# Altium project lps_display_rev_10.PrjPcb
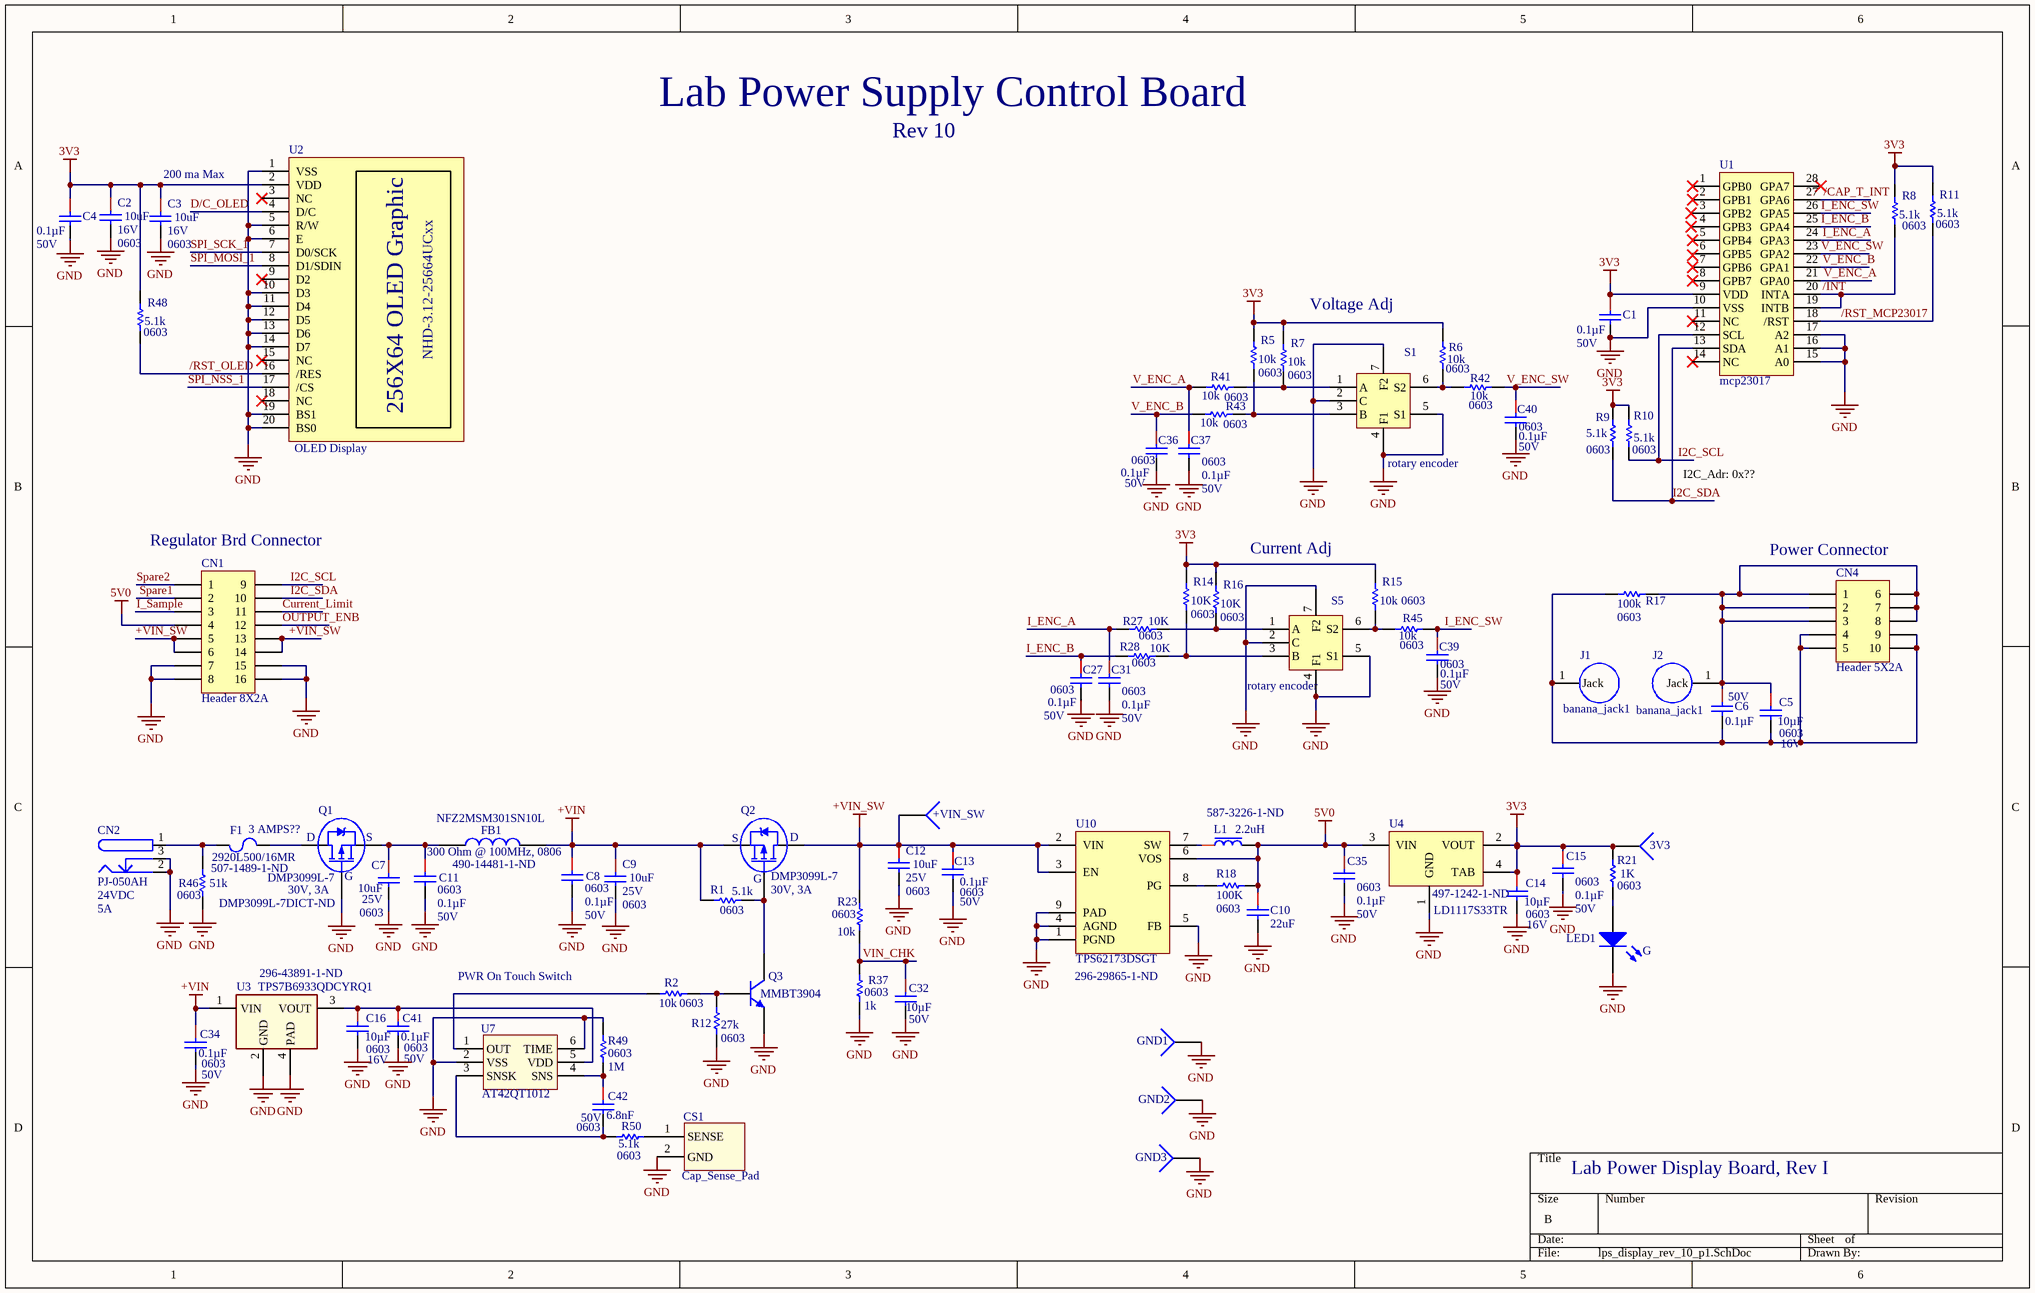
[diagram p0: lps_display_rev_10_p1.SchDoc]
2 sheets, 137 parts. Net scope: global (net labels, ports and power ports of the same name join across sheets).
Board file: lps_display_rev_10.PcbDoc
Sheets:
  lps_display_rev_10_p1.SchDoc
  lps_display_rev_10_p2.SchDoc

## Sheet lps_display_rev_10_p1.SchDoc
size B; Revision: F; SheetNumber: 1; SheetTotal: 2

### Parts
3V3  (no value)  [TestPoint-TH 35 mil]  (no BOM)
+VIN_SW  (no value)  [TestPoint-TH 35 mil]  (no BOM)
C1  Capacitance: 0.1µF  Voltage - Rated: 50V  [CAPC0603(1608)_N]  (hidden comment: 0.1uF 0603 50V)
C2  10uF  Package / Case: 0603  Voltage - Rated: 16V  [CAPC0603(1608)_N]
C3  10uF  Package / Case: 0603  Voltage - Rated: 16V  [CAPC0603(1608)_N]
C4  Capacitance: 0.1µF  Voltage - Rated: 50V  [CAPC0603(1608)_N]  (hidden comment: 0.1uF 0603 50V)
C5  Capacitance: 10µF  Package / Case: 0603  Voltage - Rated: 16V  [CAPC0603(1608)_N]  (hidden comment: 10uF)
C6  Capacitance: 0.1µF  Voltage - Rated: 50V  [CAPC0603(1608)_N]  (hidden comment: 0.1uF 0603 50V)
C7  10uF  Package / Case: 0603  Voltage - Rated: 25V  [CAPC0603(1608)_N]
C8  Package / Case: 0603  Capacitance: 0.1µF  Voltage - Rated: 50V  [CAPC0603(1608)_N]  (hidden comment: 0.1uF 0603 50V)
C9  10uF  Package / Case: 0603  Voltage - Rated: 25V  [CAPC0603(1608)_N]
C10  22uF  [CAPC0603(1608)_M]
C11  Package / Case: 0603  Capacitance: 0.1µF  Voltage - Rated: 50V  [CAPC0603(1608)_N]  (hidden comment: 0.1uF 0603 50V)
C12  10uF  Package / Case: 0603  Voltage - Rated: 25V  [CAPC0603(1608)_N]
C13  Package / Case: 0603  Capacitance: 0.1µF  Voltage - Rated: 50V  [CAPC0603(1608)_N]  (hidden comment: 0.1uF 0603 50V)
C14  Capacitance: 10µF  Package / Case: 0603  Voltage - Rated: 16V  [CAPC0603(1608)_N]  (hidden comment: 10uF)
C15  Package / Case: 0603  Capacitance: 0.1µF  Voltage - Rated: 50V  [CAPC0603(1608)_N]  (hidden comment: 0.1uF 0603 50V)
C16  Capacitance: 10µF  Package / Case: 0603  Voltage - Rated: 16V  [CAPC0603(1608)_N]  (hidden comment: 10uF)
C27  Package / Case: 0603  Capacitance: 0.1µF  Voltage - Rated: 50V  [CAPC0603(1608)_N]  (hidden comment: 0.1uF 0603 50V)
C31  Package / Case: 0603  Capacitance: 0.1µF  Voltage - Rated: 50V  [CAPC0603(1608)_N]  (hidden comment: 0.1uF 0603 50V)
C32  Capacitance: 10µF  Voltage - Rated: 50V  [CAPC0603(1608)_N]  (hidden comment: 0.1uF 0603 50V)
C34  Package / Case: 0603  Capacitance: 0.1µF  Voltage - Rated: 50V  [CAPC0603(1608)_N]  (hidden comment: 0.1uF 0603 50V)
C35  Package / Case: 0603  Capacitance: 0.1µF  Voltage - Rated: 50V  [CAPC0603(1608)_N]  (hidden comment: 0.1uF 0603 50V)
C36  Package / Case: 0603  Capacitance: 0.1µF  Voltage - Rated: 50V  [CAPC0603(1608)_N]  (hidden comment: 0.1uF 0603 50V)
C37  Package / Case: 0603  Capacitance: 0.1µF  Voltage - Rated: 50V  [CAPC0603(1608)_N]  (hidden comment: 0.1uF 0603 50V)
C39  Package / Case: 0603  Capacitance: 0.1µF  Voltage - Rated: 50V  [CAPC0603(1608)_N]  (hidden comment: 0.1uF 0603 50V)
C40  Package / Case: 0603  Capacitance: 0.1µF  Voltage - Rated: 50V  [CAPC0603(1608)_N]  (hidden comment: 0.1uF 0603 50V)
C41  Package / Case: 0603  Capacitance: 0.1µF  Voltage - Rated: 50V  [CAPC0603(1608)_N]  (hidden comment: 0.1uF 0603 50V)
C42  Package / Case: 0603  Capacitance: 6.8nF  Voltage - Rated: 50V  [CAPC0603(1608)_N]  (hidden comment: 0.1uF 0603 50V)
CN1  Header 8X2A  [HDR2X8_CEN]
CN2  PJ-050AH  Voltage - Rated: 24VDC  Current Rating: 5A  [PJ-050AH]
CN4  Header 5X2A  [HDR2X5_CEN]
CS1  Cap_Sense_Pad  [CAP_TOUCH_ROUND]
F1  2920L500/16MR  [2920 Fuse]
FB1  300 Ohm @ 100MHz, 0806  [RESC0805(2012)_M]
GND1  (no value)  [TestPoint-TH 35 mil]  (no BOM)
GND2  (no value)  [TestPoint-TH 35 mil]  (no BOM)
GND3  (no value)  [TestPoint-TH 35 mil]  (no BOM)
J1  banana_jack1  [Banana_jack1]
J2  banana_jack1  [Banana_jack1]
L1  2.2uH  [INDC2520X10N]
LED1  G  [SM-LED-0603]
Q1  DMP3099L-7  Text: 30V, 3A  [SOT23]
Q2  DMP3099L-7  Text: 30V, 3A  [SOT23]
Q3  MMBT3904  [SOT23]
R1  Resistance (Ohms): 5.1k  Package / Case: 0603  [RESC0603(1608)_N]  (hidden comment: 4.7K)
R2  Resistance (Ohms): 10k  Package / Case: 0603  [RESC0603(1608)_N]  (hidden comment: 4.7K)
R5  Resistance (Ohms): 10k  Package / Case: 0603  [RESC0603(1608)_N]  (hidden comment: 4.7K)
R6  Resistance (Ohms): 10k  Package / Case: 0603  [RESC0603(1608)_N]  (hidden comment: 4.7K)
R7  Resistance (Ohms): 10k  Package / Case: 0603  [RESC0603(1608)_N]  (hidden comment: 4.7K)
R8  Resistance (Ohms): 5.1k  Package / Case: 0603  [RESC0603(1608)_N]  (hidden comment: 4.7K)
R9  Resistance (Ohms): 5.1k  Package / Case: 0603  [RESC0603(1608)_N]  (hidden comment: 4.7K)
R10  Resistance (Ohms): 5.1k  Package / Case: 0603  [RESC0603(1608)_N]  (hidden comment: 4.7K)
R11  Resistance (Ohms): 5.1k  Package / Case: 0603  [RESC0603(1608)_N]  (hidden comment: 4.7K)
R12  Resistance (Ohms): 27k  Package / Case: 0603  [RESC0603(1608)_N]  (hidden comment: 4.7K)
R14  Resistance (Ohms): 10K  Package / Case: 0603  [RESC0603(1608)_N]  (hidden comment: 4.7K)
R15  Resistance (Ohms): 10k  Package / Case: 0603  [RESC0603(1608)_N]  (hidden comment: 4.7K)
R16  Resistance (Ohms): 10K  Package / Case: 0603  [RESC0603(1608)_N]  (hidden comment: 4.7K)
R17  Resistance (Ohms): 100k  Package / Case: 0603  [RESC0603(1608)_N]  (hidden comment: 4.7K)
R18  100K  Supplier Device Package: 0603  [RESC0603(1608)_N]
R21  Resistance (Ohms): 1K  Package / Case: 0603  [RESC0603(1608)_N]  (hidden comment: 4.7K)
R23  Package / Case: 0603  Resistance (Ohms): 10k  [RESC0603(1608)_N]  (hidden comment: 1.0K)
R27  Resistance (Ohms): 10K  Package / Case: 0603  [RESC0603(1608)_N]  (hidden comment: 4.7K)
R28  Resistance (Ohms): 10K  Package / Case: 0603  [RESC0603(1608)_N]  (hidden comment: 4.7K)
R37  Package / Case: 0603  Resistance (Ohms): 1k  [RESC0603(1608)_N]  (hidden comment: 1.0K)
R41  Resistance (Ohms): 10k  Package / Case: 0603  [RESC0603(1608)_N]  (hidden comment: 4.7K)
R42  Resistance (Ohms): 10k  Package / Case: 0603  [RESC0603(1608)_N]  (hidden comment: 4.7K)
R43  Resistance (Ohms): 10k  Package / Case: 0603  [RESC0603(1608)_N]  (hidden comment: 4.7K)
R45  Resistance (Ohms): 10k  Package / Case: 0603  [RESC0603(1608)_N]  (hidden comment: 4.7K)
R46  Package / Case: 0603  Resistance (Ohms): 51k  [RESC0603(1608)_N]  (hidden comment: 1.0K)
R48  Resistance (Ohms): 5.1k  Package / Case: 0603  [RESC0603(1608)_N]  (hidden comment: 4.7K)
R49  Package / Case: 0603  Resistance (Ohms): 1M  [RESC0603(1608)_N]  (hidden comment: 1.0K)
R50  Package / Case: 0603  Resistance (Ohms): 5.1k  [RESC0603(1608)_N]  (hidden comment: 1.0K)
S1  rotary encoder  [rotary encoder]
S5  rotary encoder  [rotary encoder]
U1  mcp23017  [SOIC28]
U2  OLED Display  [oled_graphic_256X64]
U3  TPS7B6933QDCYRQ1  [SOT-223]
U4  Supplier Part Number 1: 497-1242-1-ND  [DSO-G3]  (hidden comment: 3.3V)
U7  AT42QT1012  [SOt-23-6]
U10  TPS62173DSGT  [WSON(8) 2mm x 2mm]

### Nets
3V3: 3V3.1 C1.1 C2.1 C3.1 C4.1 C14.1 C15.1 R5.2 R6.2 R7.2 R8.2 R9.2 R10.2 R11.2 R14.2 R15.2 R16.2 R21.2 R48.2 U1.9(VDD) U2.2(VDD) U4.2(VOUT) U4.4(TAB)
5V0: C10.1 C35.1 CN1.4 L1.2 R18.1 U4.3(VIN) U10.6(VOS)
+VIN: C8.1 C9.1 C34.1 FB1.2 Q2.2(S) R1.2 U3.1(VIN)
+VIN_SW: +VIN_SW.1 C12.1 C13.1 CN1.5 CN1.6 CN1.13 CN1.14 Q2.3(D) R23.2 U10.2(VIN) U10.3(EN)
GND: C1.2 C2.2 C3.2 C4.2 C7.2 C8.2 C9.2 C10.2 C11.2 C12.2 C13.2 C14.2 C15.2 C16.2 C27.2 C31.2 C32.2 C34.2 C35.2 C36.2 C37.2 C39.2 C40.2 C41.2 CN1.7 CN1.8 CN1.15 CN1.16 CN2.2 CN2.3 CS1.2(GND) GND1.1 GND2.1 GND3.1 LED1.2 Q1.1(G) Q3.2(E) R12.2 R37.1 R46.1 R49.1 S1.2(C) S1.4(F1) S1.5(S1) S1.7(F2) S5.2(C) S5.4(F1) S5.5(S1) S5.7(F2) U1.10(VSS) U1.15(A0) U1.16(A1) U1.17(A2) U2.1(VSS) U2.5(R/W) U2.6(E) U2.10(D3) U2.11(D4) U2.12(D5) U2.13(D6) U2.14(D7) U2.19(BS1) U2.20(BS0) U3.2(GND) U3.4(PAD) U4.1(GND) U7.2(VSS) U7.6(TIME) U10.1(PGND) U10.4(AGND) U10.5(FB) U10.9(PAD)
/CAP_T_INT: U1.27(GPA6)
/INT: R8.1 U1.19(INTB) U1.20(INTA)
/RST_MCP23017: R11.1 U1.18(/RST)
/RST_OLED: R48.1 U2.16(/RES)
Current_Limit: CN1.11
D/C_OLED: U2.4(D/C)
I2C_SCL: CN1.9 R10.1 U1.12(SCL)
I2C_SDA: CN1.10 R9.1 U1.13(SDA)
I_ENC_A: C31.1 R27.2 U1.24(GPA3)
I_ENC_B: C27.1 R28.2 U1.25(GPA4)
I_ENC_SW: C39.1 R45.1 U1.26(GPA5)
I_Sample: CN1.3
OUTPUT_ENB: CN1.12
Spare1: CN1.2
Spare2: CN1.1
SPI_MOSI_1: U2.8(D1/SDIN)
SPI_NSS_1: U2.17(/CS)
SPI_SCK_1: U2.7(D0/SCK)
V_ENC_A: C37.1 R41.2 U1.21(GPA0)
V_ENC_B: C36.1 R43.2 U1.22(GPA1)
V_ENC_SW: C40.1 R42.1 U1.23(GPA2)
VIN_CHK: C32.1 R23.1 R37.2
NetC5_1: C5.1 C6.1 CN4.1 CN4.2 CN4.3 CN4.6 CN4.7 CN4.8 J2.1(Jack) R17.2
NetC5_2: C5.2 C6.2 CN4.4 CN4.5 CN4.9 CN4.10 J1.1(Jack) R17.1
NetC7_1: C7.1 C11.1 FB1.1 Q1.2(S)
NetC16_1: C16.1 C41.1 U3.3(VOUT) U7.5(VDD)
NetC42_1: C42.1 R49.2 U7.4(SNS)
NetC42_2: C42.2 R50.2 U7.3(SNSK)
NetCN2_1: CN2.1 F1.1 R46.2
NetCS1_1: CS1.1(SENSE) R50.1
NetF1_2: F1.2 Q1.3(D)
NetL1_1: L1.1 U10.7(SW)
NetLED1_1: LED1.1 R21.1
NetQ2_1: Q2.1(G) Q3.3(C) R1.1
NetQ3_1: Q3.1(B) R2.1 R12.1
NetR2_2: R2.2 U7.1(OUT)
NetR5_1: R5.1 R43.1 S1.3(B)
NetR6_1: R6.1 R42.2 S1.6(S2)
NetR7_1: R7.1 R41.1 S1.1(A)
NetR14_1: R14.1 R28.1 S5.3(B)
NetR15_1: R15.1 R45.2 S5.6(S2)
NetR16_1: R16.1 R27.1 S5.1(A)
NetR18_2: R18.2 U10.8(PG)

Not connected (* = marked no-connect by the designer): U1 1(GPB0)* 2(GPB1)* 3(GPB2) 4(GPB3) 5(GPB4)* 6(GPB5) 7(GPB6)* 8(GPB7)* 11(NC)* 14(NC)* 28(GPA7)*; U2 3(NC)* 9(D2)* 15(NC)* 18(NC)*

### Notes on the sheet
- Lab Power Supply Control Board
- Rev 10
- (near C3) 200 ma Max
- Voltage Adj
- I2C_Adr: 0x??
- (near CN1) Regulator Brd Connector
- Current Adj
- (near CN4) Power Connector
- (near F1) 3 AMPS??
- (near Q1) D
- (near Q1) S
- (near FB1) NFZ2MSM301SN10L
- (near Q2) S
- (near Q2) D
- (near L1) 587-3226-1-ND
- (near R46) 507-1489-1-ND
- DMP3099L-7DICT-ND
- (near Q1) G
- (near FB1) 490-14481-1-ND
- (near Q2) G
- 296-43891-1-ND
- LD1117S33TR
- PWR On Touch Switch
- (near U10) 296-29865-1-ND
- Lab Power Display Board, Rev I
- (in symbol OLED Display) NHD-3.12-25664UCxx; 256X64 OLED Graphic

### Library data of the parts
3V3 +VIN_SW GND1-GND3 = TestPoint: Test Point
C1 C4 C6 C32 = CAP CER 0.1UF 50V 10% X7R 0603: Manufacturer: Kemet; Manufacturer Part Number: C0603C104K5RACTU; Tolerance: ±10%; Temperature Coefficient: X7R; ClassName: AD1; Supplier 1: Digi-Key; RoHS: RoHS Compliant; Category: Capacitors; Stock 1: 1397942; Pricing 1: 1=0.1, 10=0.041, 50=0.0222, 100=0.0187, 250=0.01532, 500=0.0131, 1000=0.0102 (USD); Packaging: Cut Tape (CT); Mounting Type: Surface Mount, MLCC; Operating Temperature: -55°C ~ 125°C; Applications: General Purpose; Ratings: -; Package / Case: 0603 (1608 Metric); Size / Dimension: 0.063" L x 0.031" W (1.60mm x 0.80mm); Height - Seated (Max): -; Thickness (Max): 0.034" (0.87mm); Lead Spacing: -; Features: -; Lead Style: -; ComponentLink1URL: http://www.kemet.com/docfinder?Partnumber=C0603C104K5RACTU; ComponentLink1Description: http://www.kemet.com/docfinder?Partnumber=C0603C104K5RACTU; Supplier Part Number 1: 399-5089-1-ND
C2 C3 C7 C9 C12 = CAP CER 10UF 16V 20% X5R 0603: 10UF 0603 16V; Manufacturer: Murata Electronics North America; Manufacturer Part Number: GRM188R61C106MA73D; Capacitance: 10µF; Tolerance: ±20%; Temperature Coefficient: X5R; Supplier 1: Digi-Key; RoHS: RoHS Compliant; Category: Capacitors; Stock 1: 99081; Pricing 1: 1=0.18, 10=0.167, 25=0.1428, 50=0.1214, 100=0.1167, 250=0.1048, 500=0.10002, 1000=0.08335 (USD); Packaging: Cut Tape (CT); Mounting Type: Surface Mount, MLCC; Operating Temperature: -55°C ~ 85°C; Applications: General Purpose; Ratings: -; Size / Dimension: 0.063" L x 0.031" W (1.60mm x 0.80mm); Height - Seated (Max): -; Thickness (Max): 0.031" (0.80mm); Lead Spacing: -; Features: -; Lead Style: -; ComponentLink1URL: http://www.murata.com/~/media/webrenewal/support/library/catalog/products/capacitor/mlcc/c02e.ashx; ComponentLink1Description: http://www.murata.com/~/media/webrenewal/support/library/catalog/products/capacitor/mlcc/c02e.ashx; Supplier Part Number 1: 490-7201-1-ND
C5 C14 C16 = CAP CER 10UF 16V 20% X5R 0603: 10UF 0603 16V; Manufacturer: Murata Electronics North America; Manufacturer Part Number: GRM188R61C106MA73D; Tolerance: ±20%; Temperature Coefficient: X5R; Supplier 1: Digi-Key; RoHS: RoHS Compliant; Category: Capacitors; Stock 1: 99081; Pricing 1: 1=0.18, 10=0.167, 25=0.1428, 50=0.1214, 100=0.1167, 250=0.1048, 500=0.10002, 1000=0.08335 (USD); Packaging: Cut Tape (CT); Mounting Type: Surface Mount, MLCC; Operating Temperature: -55°C ~ 85°C; Applications: General Purpose; Ratings: -; Size / Dimension: 0.063" L x 0.031" W (1.60mm x 0.80mm); Height - Seated (Max): -; Thickness (Max): 0.031" (0.80mm); Lead Spacing: -; Features: -; Lead Style: -; ComponentLink1URL: http://www.murata.com/~/media/webrenewal/support/library/catalog/products/capacitor/mlcc/c02e.ashx; ComponentLink1Description: http://www.murata.com/~/media/webrenewal/support/library/catalog/products/capacitor/mlcc/c02e.ashx; Supplier Part Number 1: 490-7201-1-ND
C8 C11 C13 C15 C27 C31 C34-C37 C39-C42 = CAP CER 0.1UF 50V 10% X7R 0603: Manufacturer: Yageo; Manufacturer Part Number: CC0603ZRY5V9BB104; Tolerance: -20%, +80%; Temperature Coefficient: Y5V (F); ClassName: *; Supplier 1: Digi-Key; RoHS: RoHS Compliant; Category: Capacitors; Stock 1: 2192156; Pricing 1: 1=0.1, 10=0.019, 100=0.0087, 500=0.0062, 1000=0.00487 (USD); Packaging: Cut Tape (CT); Part Status: Active; Operating Temperature: -30°C ~ 85°C; Features: -; Ratings: -; Applications: General Purpose; Failure Rate: -; Mounting Type: Surface Mount, MLCC; Size / Dimension: 0.063" L x 0.031" W (1.60mm x 0.80mm); Height - Seated (Max): -; Thickness (Max): 0.035" (0.90mm); Lead Spacing: -; Lead Style: -; ComponentLink1URL: http://www.yageo.com/documents/recent/UPY-GPHC_Y5V_6.3V-to-50V_8.pdf; ComponentLink1Description: http://www.yageo.com/documents/recent/UPY-GPHC_Y5V_6.3V-to-50V_8.pdf; Supplier Part Number 1: 311-1343-1-ND
C10 = CMP-001-0737-02: CAP CER 22UF 10V 20% 0603; Dielectric: X5R; Material: Ceramic; Max Operating Temperature: 85°C; Termination: SMD/SMT; Case Code (Metric): 1608; Voltage Rating (DC): 10V; Width: 0.8mm; Length: 1.6mm; Packaging: Tape and Reel; Case Code (Imperial): 0603; Capacitance: 22uF; Tolerance: 20%; Mount: Surface Mount; Weight: 0.000222oz; Package Quantity: 4000; Min Operating Temperature: -55°C; Lead Free: Lead Free; REACH SVHC: No SVHC; Thickness: 0.039inch; Depth: 0.8mm; Voltage Rating: 10V; Height: 0.8mm; Case/Package: 0603
CN1 = CMP-001-0325-01: Header, 8-Pin, Dual row; Signal Integrity: Connector; Publisher: Altium Limited; Designator: Header 8X2A; LatestRevisionNote: Re-released for DXP Platform.; Pin Count: 16; Component Name: Header 8X2A; LatestRevisionDate: 17-Jul-2002
CN2 = CMP-001-0507-01: Power Barrel Connector Jack 2.00mm ID 5.50mm OD Through Hole, Right Angle; Manufacturer: CUI; Plug/Mating Plug Diameter: 2.1mm ID, 5.5mm OD; Internal Switch(s): Single Switch, Normally Closed; Shielding: Unshielded; Number of Positions/Contacts: 2 Conductors, 3 Contacts; Gender: Male; Stock 1: 4408; ComponentLink1Description: http://www.mouser.com/ds/2/670/PJ-050AH-524150.pdf; Pin Count: 3; Features: -; Housing Color: Black; Contact Material - Plating: Nickel; Termination: Solder; Mounting Type: Through Hole, Right Angle; Color: Black; Component Name: PJ-050AH; Series: -; Pricing 1: 1=0.78, 10=0.689, 25=0.648, 50=0.621, 100=0.594, 250=0.54, 500=0.486, 1000=0.432, 2500=0.3915 (USD); Housing Material: Thermoplastic; Operating Temperature: -25°C ~ 85°C; Connector Type: Jack; Contact Material: Copper; Family: Barrel - Power Connectors; ComponentLink1URL: http://www.mouser.com/ds/2/670/PJ-050AH-524150.pdf; Manufacturer Part Number: PJ-050AH; Designator: PJ-050AH
CN4 = CMP-001-0310-01: Header, 5-Pin, Dual row; Signal Integrity: Connector; Designator: Header 5X2A; Component Name: Header 5X2A; LatestRevisionDate: 17-Jul-2002; LatestRevisionNote: Re-released for DXP Platform.; Pin Count: 10; Publisher: Altium Limited
F1 = CMP-001-0852-01: PTC RESET FUSE 16V 5A 2920; Max Power Dissipation: 2W; Max Current Rating: 40A; Time to Trip: 5s; Trip Current: 10A; Height: 1.6mm; Voltage Rating (DC): 16V; Case/Package: 2920; Length: 7.98mm; Case Code (Imperial): 2920; Packaging: Tape and Reel; Width: 5.44mm; Package Quantity: 1; Max Operating Temperature: 85°C; Hold Current: 5A; REACH SVHC: No SVHC; Lead Free: Lead Free; Case Code (Metric): 7351; Min Operating Temperature: -40°C; Termination: SMD/SMT
FB1 = FERRITE 40 OHM 1.5A 0805: 40 OHM 0805 1.5A; Manufacturer: Laird-Signal Integrity Products; Manufacturer Part Number: MI0805K400R-10; DC Resistance (DCR): 50 mOhm Max; Filter Type: Differential Mode - Single; Impedance @ Frequency: 40 Ohm @ 100MHz; Creator: osman; Supplier 1: Digi-Key; RoHS: RoHS Compliant; Category: Filters; Stock 1: 112318; Pricing 1: 1=0.1, 10=0.077, 25=0.07, 50=0.0628, 100=0.0461, 250=0.03352, 500=0.03074, 1000=0.02654 (USD); Packaging: Cut Tape (CT); Current Rating: 1.5A; Package / Case: 0805 (2012 Metric); Mounting Type: Surface Mount; Height (Max): 0.043" (1.10mm); Size / Dimension: 0.079" L x 0.049" W (2.00mm x 1.25mm); ComponentLink1URL: http://staging.lairdtech.com/WorkArea/linkit.aspx?LinkIdentifier=id&ItemID=4949; ComponentLink1Description: http://staging.lairdtech.com/WorkArea/linkit.aspx?LinkIdentifier=id&ItemID=4949; Supplier Part Number 1: 240-2389-1-ND
L1 = CMP-001-0772-02: FIXED IND 2.2UH 1.9A 117 MOHM; Shielding: Shielded; Inductance Tolerance: 20%; Test Frequency: 2MHz; Saturation Current: 2A; DC Resistance (DCR): 117mR; Core Material: Ferrite, Metal; Mount: Surface Mount; Case/Package: 1008; Composition: Wirewound; Halogen Free: Halogen Free; RMS Current (Irms): 1.9A; Length: 2.5mm; Inductance: 2.2uh; Tolerance: 20%; Height: 1.2mm; Height - Seated (Max): 0.047inch; REACH SVHC: Unknown; Case Code (Imperial): 1008; Width: 0.079inch; Min Operating Temperature: -40°C; Termination: SMD/SMT; Max DC Current: 1.9A; Current Rating: 1.9A; Radiation Hardening: No; Case Code (Metric): 2520; Packaging: Tape and Reel; Package Quantity: 3000; Max Operating Temperature: 105°C
LED1 = 0603 LED: 0603 SMD LED; PN: P11500CT-ND; Vendor: Digikey
Q1 Q2 = DMP3099L-7: DMP3099L-7 MOSFET P-CH SOT23; Manufacturer: Diodes Incorporated; FET Type: P-Channel; Current - Continuous Drain (Id) @ 25°C: 3.8A (Ta); Drive Voltage (Max Rds On,  Min Rds On): 4.5V, 10V; Vgs(th) (Max) @ Id: 2.1V @ 250µA; Vgs (Max): ±20V; Power Dissipation (Max): 1.08W (Ta); Rds On (Max) @ Id, Vgs: 65 mOhm @ 3.8A, 10V; Supplier 1: Digi-Key; Manufacturer Part Number: DMP3099L-7; RoHS: RoHS Compliant; Category: Discrete Semiconductor Products; Stock 1: 138833; Pricing 1: 1=0.42, 10=0.306, 100=0.1801, 500=0.10198, 1000=0.07818 (USD); Packaging: Cut Tape (CT); Part Status: Active; Technology: MOSFET (Metal Oxide); FET Feature: -; Operating Temperature: -55°C ~ 150°C (TJ); Mounting Type: Surface Mount; Supplier Device Package: SOT-23; Package / Case: TO-236-3, SC-59, SOT-23-3; ComponentLink1URL: https://www.diodes.com/assets/Datasheets/DMP3099L.pdf; ComponentLink1Description: https://www.diodes.com/assets/Datasheets/DMP3099L.pdf; Supplier Part Number 1: DMP3099L-7DICT-ND
Q3 = MMBT3904: MMBT3904 NPN; Manufacturer: ON Semiconductor; MPN: MMBT3904WT1G; Vendor: Digikey; PN: MMBT3904WT1GOSCT-ND; Current - Collector (Ic) (Max): 200mA; Voltage - Collector Emitter Breakdown (Max): 40V; Vce Saturation (Max) @ Ib, Ic: 300mV @ 5mA, 50mA; DC Current Gain (hFE) (Min) @ Ic, Vce: 100 @ 10mA, 1V; Power - Max: 150mW; Frequency - Transition: 300MHz; Supplier 1: Digi-Key; Manufacturer Part Number: MMBT3904WT1G; RoHS: RoHS Compliant; Category: Discrete Semiconductor Products; Stock 1: 3; Pricing 1: 1=0.17, 10=0.154, 25=0.1404, 100=0.101, 250=0.05952, 500=0.04938, 1000=0.03368 (USD); Packaging: Cut Tape (CT); Transistor Type: NPN; Current - Collector Cutoff (Max): -; Mounting Type: Surface Mount; Package / Case: SC-70, SOT-323; Supplier Device Package: SC-70-3 (SOT323); ComponentLink1URL: http://www.onsemi.com/pub_link/Collateral/MMBT3904WT1-D.PDF; ComponentLink1Description: http://www.onsemi.com/pub_link/Collateral/MMBT3904WT1-D.PDF; Supplier Part Number 1: MMBT3904WT1GOSCT-ND
R1 R2 R5-R12 R14-R17 R21 R27 R28 R41-R43 R45 R48 = RES 4.7K OHM 1/10W 5% 0603 SMD: 4.7K 0603; Manufacturer: Panasonic Electronic Components; Manufacturer Part Number: ERJ-3GEYJ472V; Tolerance: ±5%; Power (Watts): 0.1W, 1/10W; Temperature Coefficient: ±200ppm/°C; Supplier 1: Digi-Key; RoHS: RoHS Compliant; Category: Resistors; Stock 1: 1261582; Pricing 1: 1=0.1, 50=0.0126, 100=0.0096, 250=0.00716, 500=0.00528, 1000=0.00352, 2500=0.00297 (USD); Packaging: Cut Tape (CT); Composition: Thick Film; Features: Automotive AEC-Q200 Qualified; Supplier Device Package: 0603; Size / Dimension: 0.063" L x 0.031" W (1.60mm x 0.80mm); Height: 0.022" (0.55mm); Number of Terminations: 2; ComponentLink1URL: http://industrial.panasonic.com/www-cgi/jvcr13pz.cgi?E+PZ+3+AOA0001+ERJ3GEYJ472V+7+WW; ComponentLink1Description: http://industrial.panasonic.com/www-cgi/jvcr13pz.cgi?E+PZ+3+AOA0001+ERJ3GEYJ472V+7+WW; Supplier Part Number 1: P4.7KGCT-ND
R18 = RES 100K OHM 1% 1/10W 0603: 100K 0603; Manufacturer: Yageo; Manufacturer Part Number: RC0603FR-07100KL; Tolerance: ±1%; Power (Watts): 0.1W, 1/10W; Temperature Coefficient: ±100ppm/°C; Supplier 1: Digi-Key; RoHS: RoHS Compliant; Category: Resistors; Stock 1: 13526613; Pricing 1: 1=0.1, 10=0.015, 100=0.006, 1000=0.00268, 2500=0.00233 (USD); Packaging: Cut Tape (CT); Part Status: Active; Composition: Thick Film; Features: Moisture Resistant; Operating Temperature: -55°C ~ 155°C; Package / Case: 0603 (1608 Metric); Size / Dimension: 0.063" L x 0.032" W (1.60mm x 0.80mm); Height - Seated (Max): 0.022" (0.55mm); Failure Rate: -; ComponentLink1URL: http://www.yageo.com/documents/recent/PYu-RC_Group_51_RoHS_L_8.pdf; ComponentLink1Description: http://www.yageo.com/documents/recent/PYu-RC_Group_51_RoHS_L_8.pdf; Supplier Part Number 1: 311-100KHRCT-ND
R23 R37 R46 R49 R50 = RES 1K OHM 1% 1/10W 0603: 1.0K 0603; Manufacturer: Stackpole Electronics Inc.; Manufacturer Part Number: RMCF0603FT1K00; Tolerance: ±1%; Power (Watts): 0.1W, 1/10W; Temperature Coefficient: ±100ppm/°C; Supplier 1: Digi-Key; RoHS: RoHS Compliant; Category: Resistors; Stock 1: 411308; Pricing 1: 1=0.1, 10=0.02, 100=0.0081, 1000=0.00364, 2500=0.00316 (USD); Packaging: Cut Tape (CT); Part Status: Active; Composition: Thick Film; Features: Automotive AEC-Q200; Operating Temperature: -55°C ~ 155°C; Size / Dimension: 0.061" L x 0.031" W (1.55mm x 0.80mm); Height - Seated (Max): 0.022" (0.55mm); Failure Rate: -; ComponentLink1URL: https://www.seielect.com/Catalog/SEI-RMCF_RMCP.pdf; ComponentLink1Description: https://www.seielect.com/Catalog/SEI-RMCF_RMCP.pdf; Supplier Part Number 1: RMCF0603FT1K00CT-ND; Supplier Device Package: 0603
U1 = mcp23017: I2C 16 bit Expander
U3 = R-78E5.0-0.5
U4 = LD1117S33: 3.3 volt fixed regulator, 800mA; Supplier 1: Digi-Key
U7 = AT42QT1012: CAP QTouch Chip
U10 = CMP-001-1046-01: IC REG BUCK ADJ 0.5A SYNC 8WSON; Min Input Voltage: 3V; Output Configuration: Positive; Max Output Current: 500mA; Min Output Voltage: 900mV; Max Output Voltage: 6V; Max Input Voltage: 17V; Switching Frequency: 2.25MHz; Output Type: Adjustable; Quiescent Current: 17uA; Synchronous Rectifier: Yes; Number of Outputs: 1; REACH SVHC: No SVHC; Lead Free: Lead Free; Output Current: 500mA; Contact Plating: Gold; Output Voltage: 6V; Radiation Hardening: No; Number of Pins: 8; Operating Supply Voltage: 17V; Packaging: Tape and Reel; Package Quantity: 3000; Min Operating Temperature: -40°C; Max Operating Temperature: 125°C

## Sheet lps_display_rev_10_p2.SchDoc: TRIM CAN
size B; Author: JO; DrawnBy: JO; Engineer: JO; DocumentNumber: 091117; Revision: H; SheetNumber: 1; SheetTotal: 1; PageSetup: Record=PageOptions|CenterHorizontal=True|CenterVertical=True|PrintScale=0.95|XCorrection=1.00|YCorrection=1.00|PrintKind=1|BorderSize=5000000|LeftOffset=0|BottomOffset=0|Orientation=2|PaperLength=1000|PaperWidth=1000|Scale=100|PaperSource=7|PrintQuality=-4|MediaType=1|DitherType=10|PaperKind=Letter|PrintScaleMode=1; DocumentName: TRIM CAN
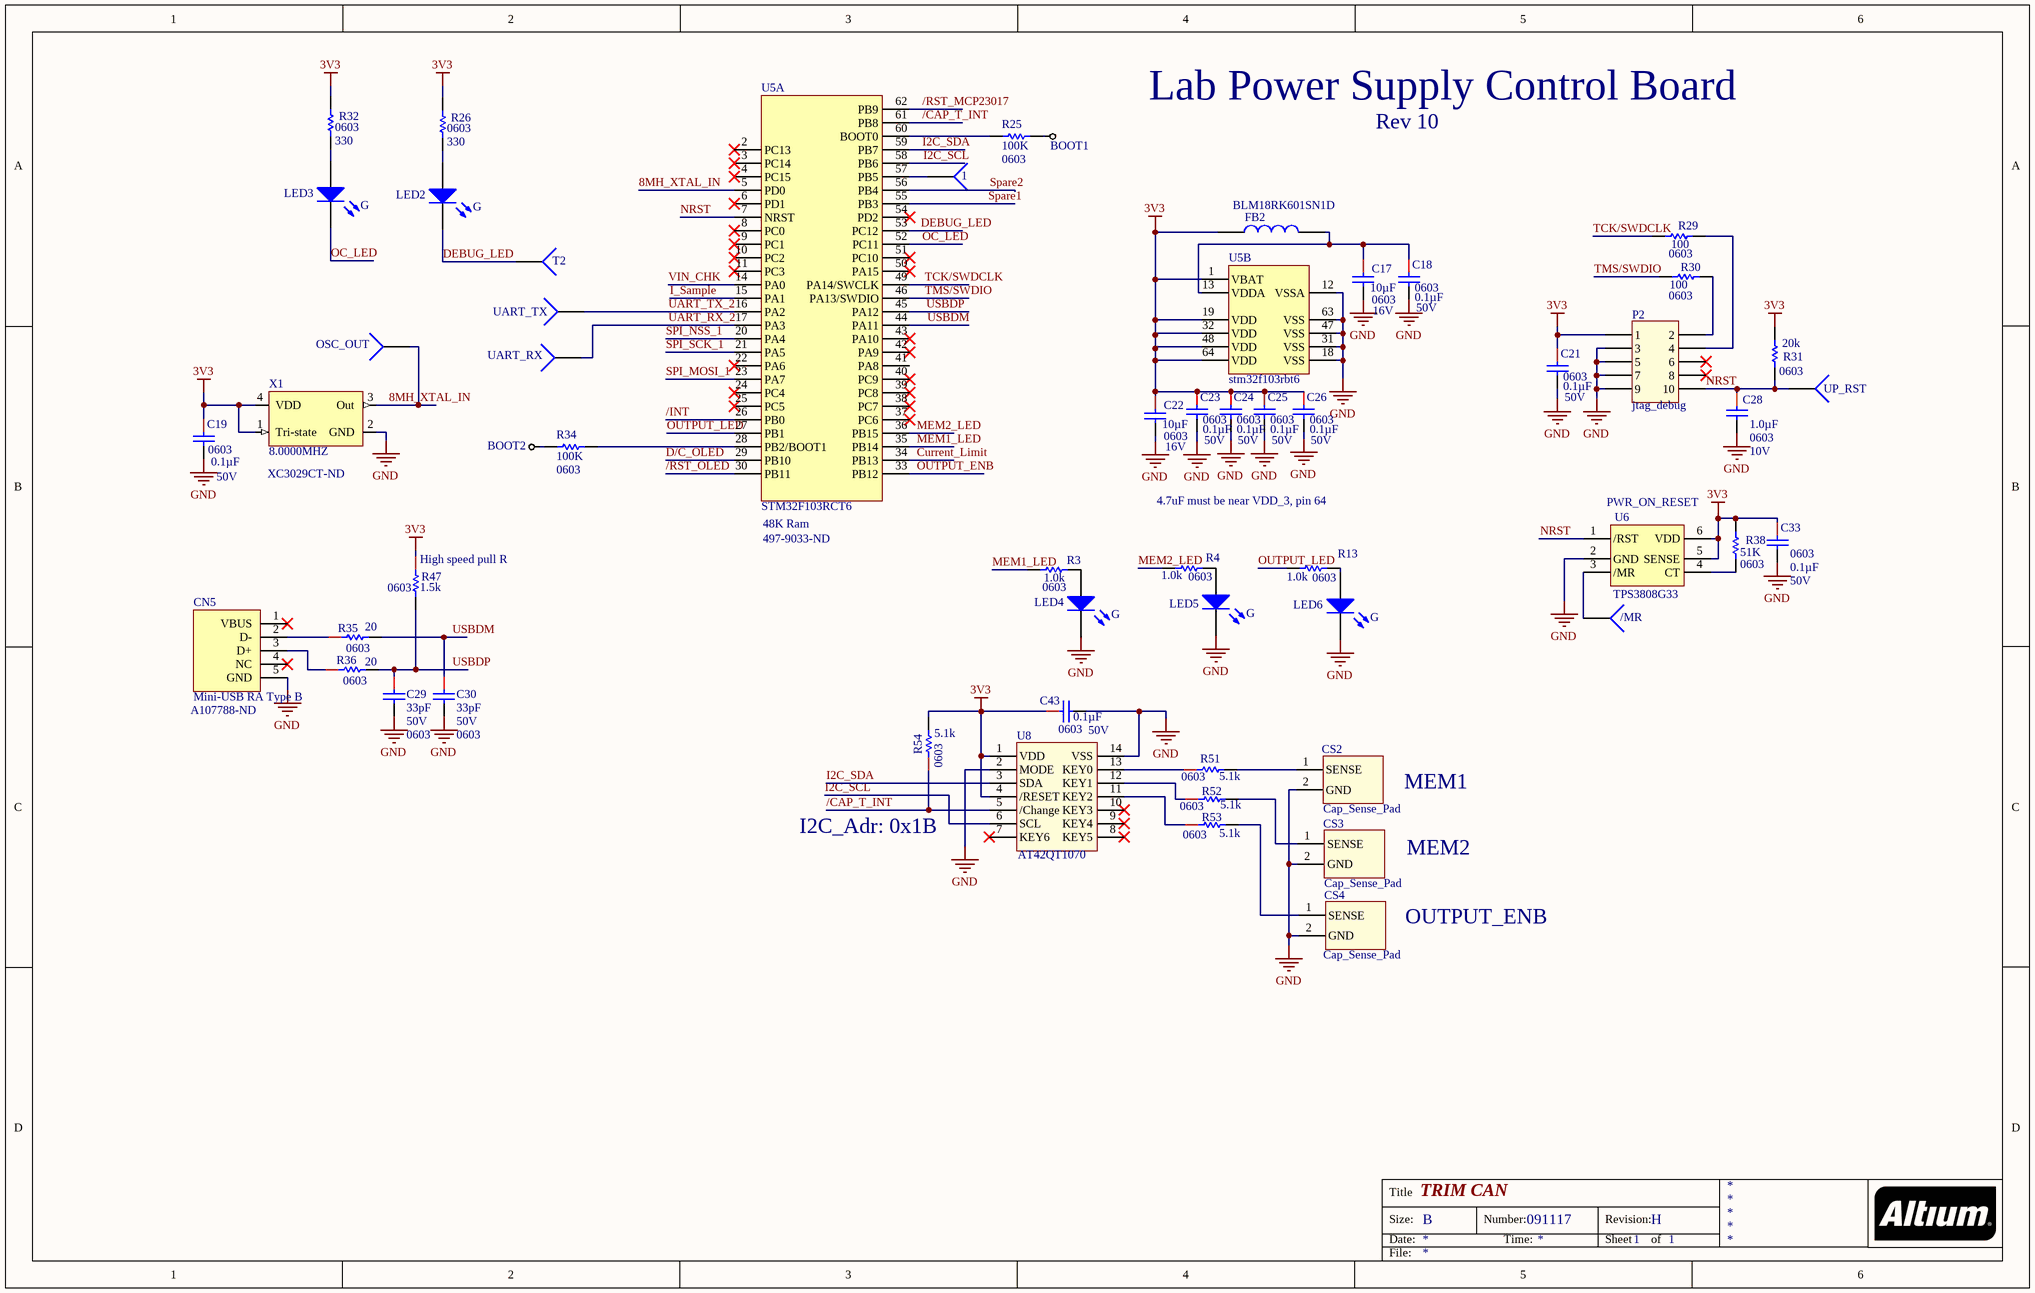
[diagram p1: lps_display_rev_10_p2.SchDoc]

### Parts
1  (no value)  [TestPoint-TH 35 mil]  (no BOM)
/MR  (no value)  [TestPoint-TH 35 mil]  (no BOM)
BOOT1  TP  [TestPoint-TH 40 mil]  (value not drawn)
BOOT2  TP  [TestPoint-TH 40 mil]  (value not drawn)
C17  Capacitance: 10µF  Package / Case: 0603  Voltage - Rated: 16V  [CAPC0603(1608)_N]  (hidden comment: 10uF)
C18  Package / Case: 0603  Capacitance: 0.1µF  Voltage - Rated: 50V  [CAPC0603(1608)_N]  (hidden comment: 0.1uF 0603 50V)
C19  Package / Case: 0603  Capacitance: 0.1µF  Voltage - Rated: 50V  [CAPC0603(1608)_N]  (hidden comment: 0.1uF 0603 50V)
C21  Package / Case: 0603  Capacitance: 0.1µF  Voltage - Rated: 50V  [CAPC0603(1608)_N]  (hidden comment: 0.1uF 0603 50V)
C22  Capacitance: 10µF  Package / Case: 0603  Voltage - Rated: 16V  [CAPC0603(1608)_N]  (hidden comment: 10uF)
C23  Package / Case: 0603  Capacitance: 0.1µF  Voltage - Rated: 50V  [CAPC0603(1608)_N]  (hidden comment: 0.1uF 0603 50V)
C24  Package / Case: 0603  Capacitance: 0.1µF  Voltage - Rated: 50V  [CAPC0603(1608)_N]  (hidden comment: 0.1uF 0603 50V)
C25  Package / Case: 0603  Capacitance: 0.1µF  Voltage - Rated: 50V  [CAPC0603(1608)_N]  (hidden comment: 0.1uF 0603 50V)
C26  Package / Case: 0603  Capacitance: 0.1µF  Voltage - Rated: 50V  [CAPC0603(1608)_N]  (hidden comment: 0.1uF 0603 50V)
C28  Capacitance: 1.0µF  Package / Case: 0603  Voltage - Rated: 10V  [CAPC0603(1608)_N]  (hidden comment: 1uF)
C29  33pF  Voltage (Rated): 50V  Package (Imperial): 0603  [CAPC0603(1608)_M]
C30  33pF  Voltage (Rated): 50V  Package (Imperial): 0603  [CAPC0603(1608)_M]
C33  Package / Case: 0603  Capacitance: 0.1µF  Voltage - Rated: 50V  [CAPC0603(1608)_N]  (hidden comment: 0.1uF 0603 50V)
C43  Package / Case: 0603  Capacitance: 0.1µF  Voltage - Rated: 50V  [CAPC0603(1608)_N]  (hidden comment: 0.1uF 0603 50V)
CN5  Mini-USB RA Type B  [USB-MINI-B - 2A]
CS2  Cap_Sense_Pad  [CAP_TOUCH_ROUND]
CS3  Cap_Sense_Pad  [CAP_TOUCH_ROUND]
CS4  Cap_Sense_Pad  [CAP_TOUCH_ROUND]
FB2  BLM18RK601SN1D  [RESC0603(1608)_N]
LED2  G  [SM-LED-0603]
LED3  G  [SM-LED-0603]
LED4  G  [SM-LED-0603]
LED5  G  [SM-LED-0603]
LED6  G  [SM-LED-0603]
OSC_OUT  (no value)  [TestPoint-TH 35 mil]  (no BOM)
P2  jtag_debug  [jtag_debug]
R3  Package / Case: 0603  [RESC0603(1608)_N]  (hidden comment: 1.0K)
R4  Package / Case: 0603  [RESC0603(1608)_N]  (hidden comment: 1.0K)
R13  Package / Case: 0603  [RESC0603(1608)_N]  (hidden comment: 1.0K)
R25  100K  Supplier Device Package: 0603  [RESC0603(1608)_N]
R26  Package / Case: 0603  Resistance (Ohms): 330  [RESC0603(1608)_N]  (hidden comment: 1.0K)
R29  Package / Case: 0603  [RESC0603(1608)_N]  (hidden comment: 100)
R30  Package / Case: 0603  [RESC0603(1608)_N]  (hidden comment: 100)
R31  Resistance (Ohms): 20k  Package / Case: 0603  [RESC0603(1608)_N]  (hidden comment: 10K 1%)
R32  Package / Case: 0603  Resistance (Ohms): 330  [RESC0603(1608)_N]  (hidden comment: 1.0K)
R34  100K  Supplier Device Package: 0603  [RESC0603(1608)_N]
R35  Package (Imperial): 0603  Resistance: 20  [RESC0603(1608)_M]  (hidden comment: 22)
R36  Package (Imperial): 0603  Resistance: 20  [RESC0603(1608)_M]  (hidden comment: 22)
R38  Resistance (Ohms): 51K  Package / Case: 0603  [RESC0603(1608)_N]  (hidden comment: 4.7K)
R47  Package (Imperial): 0603  Resistance: 1.5k  [RESC0603(1608)_M]  (hidden comment: 1.54K)
R51  Package (Imperial): 0603  [RESC1608X55X30NL15T15]  (hidden comment: 5.1K)
R52  Package (Imperial): 0603  [RESC1608X55X30NL15T15]  (hidden comment: 5.1K)
R53  Package (Imperial): 0603  [RESC1608X55X30NL15T15]  (hidden comment: 5.1K)
R54  Package (Imperial): 0603  [RESC1608X55X30NL15T15]  (hidden comment: 5.1K)
T2  (no value)  [TestPoint-TH 35 mil]  (no BOM)
U5  STM32F103RCT6  [LQFP64]  (parts A,B of 2)
U6  TPS3808G33  [SOt-23-6]
U8  AT42QT1070  [SOP14]
UART_RX  (no value)  [TestPoint-TH 35 mil]  (no BOM)
UART_TX  (no value)  [TestPoint-TH 35 mil]  (no BOM)
UP_RST  (no value)  [TestPoint-TH 35 mil]  (no BOM)
X1  8.0000MHZ  [ECS-TXO-2520-33-160-AN-TR-Footprint-1]

### Nets
3V3: C19.1 C21.1 C22.1 C23.1 C24.1 C25.1 C26.1 C33.1 C43.1 FB2.1 P2.1 R26.2 R31.1 R32.2 R38.2 R47.1 R54.2 U5.1(VBAT) U5.19(VDD) U5.32(VDD) U5.48(VDD) U5.64(VDD) U6.5(SENSE) U6.6(VDD) U8.1(VDD) U8.4(/RESET) X1.1(Tri-state) X1.4(VDD)
GND: C17.2 C18.2 C19.2 C21.2 C22.2 C23.2 C24.2 C25.2 C26.2 C28.2 C29.2 C30.2 C33.2 C43.2 CN5.0(GND) CN5.5(GND) CS2.2(GND) CS3.2(GND) CS4.2(GND) LED4.2 LED5.2 LED6.2 P2.3 P2.5 P2.7 P2.9 U5.12(VSSA) U5.18(VSS) U5.31(VSS) U5.47(VSS) U5.63(VSS) U6.2(GND) U8.2(MODE) U8.14(VSS) X1.2(GND)
8MH_XTAL_IN: OSC_OUT.1 U5.5(PD0) X1.3(Out)
/CAP_T_INT: R54.1 U5.61(PB8) U8.5(/Change)
/INT: U5.26(PB0)
/RST_MCP23017: U5.62(PB9)
/RST_OLED: U5.30(PB11)
Current_Limit: U5.34(PB13)
D/C_OLED: U5.29(PB10)
DEBUG_LED: LED2.2 T2.1 U5.53(PC12)
I2C_SCL: U5.58(PB6) U8.6(SCL)
I2C_SDA: U5.59(PB7) U8.3(SDA)
I_Sample: U5.15(PA1)
MEM1_LED: R3.1 U5.35(PB14)
MEM2_LED: R4.1 U5.36(PB15)
NRST: C28.1 P2.10 R31.2 U5.7(NRST) U6.1(/RST) UP_RST.1
OC_LED: LED3.2 U5.52(PC11)
OUTPUT_ENB: U5.33(PB12)
OUTPUT_LED: R13.1 U5.27(PB1)
Spare1: U5.55(PB3)
Spare2: U5.56(PB4)
SPI_MOSI_1: U5.23(PA7)
SPI_NSS_1: U5.20(PA4)
SPI_SCK_1: U5.21(PA5)
TCK/SWDCLK: R29.2 U5.49(PA14/SWCLK)
TMS/SWDIO: R30.2 U5.46(PA13/SWDIO)
UART_RX_2: U5.17(PA3) UART_RX.1
UART_TX_2: U5.16(PA2) UART_TX.1
USBDM: C30.1 R35.2 U5.44(PA11)
USBDP: C29.1 R36.2 R47.2 U5.45(PA12)
VIN_CHK: U5.14(PA0)
Net1_1: 1.1 U5.57(PB5)
Net/MR_1: /MR.1 U6.3(/MR)
NetBOOT1_1: BOOT1.1 R25.1
NetBOOT2_1: BOOT2.1 R34.2
NetC17_1: C17.1 C18.1 FB2.2 U5.13(VDDA)
NetCN5_2: CN5.2(D-) R35.1
NetCN5_3: CN5.3(D+) R36.1
NetCS2_1: CS2.1(SENSE) R51.2
NetCS3_1: CS3.1(SENSE) R52.2
NetCS4_1: CS4.1(SENSE) R53.2
NetLED2_1: LED2.1 R26.1
NetLED3_1: LED3.1 R32.1
NetLED4_1: LED4.1 R3.2
NetLED5_1: LED5.1 R4.2
NetLED6_1: LED6.1 R13.2
NetP2_2: P2.2 R30.1
NetP2_4: P2.4 R29.1
NetR25_2: R25.2 U5.60(BOOT0)
NetR34_1: R34.1 U5.28(PB2/BOOT1)
NetR38_1: R38.1 U6.4(CT)
NetR51_1: R51.1 U8.13(KEY0)
NetR52_1: R52.1 U8.12(KEY1)
NetR53_1: R53.1 U8.11(KEY2)

Not connected (* = marked no-connect by the designer): CN5 1(VBUS)* 4(NC)*; P2 6* 8*; U5 2(PC13)* 3(PC14)* 4(PC15)* 6(PD1)* 8(PC0)* 9(PC1)* 10(PC2)* 11(PC3)* 22(PA6)* 24(PC4)* 25(PC5)* 37(PC6)* 38(PC7)* 39(PC8)* 40(PC9)* 41(PA8) 42(PA9)* 43(PA10)* 50(PA15)* 51(PC10)* 54(PD2)*; U8 7(KEY6)* 8(KEY5)* 9(KEY4)* 10(KEY3)*

### Notes on the sheet
- Lab Power Supply Control Board
- Rev 10
- (near X1) XC3029CT-ND
- 4.7uF must be near VDD_3, pin 64
- (near U6) PWR_ON_RESET
- (near R47) High speed pull R
- (near U5) 48K Ram
- 497-9033-ND
- (near CN5) A107788-ND
- I2C_Adr: 0x1B
- MEM1
- MEM2
- OUTPUT_ENB
- Title
- Size:
- Date:
- B
- Number:
- Time:
- Revision:
- Sheet
- of
- File:

### Library data of the parts
1 /MR OSC_OUT T2 UART_RX UART_TX UP_RST = TestPoint: Test Point
BOOT1 BOOT2 = TestPoint-PC-W: Test Point White; Manufacturer: Keystone Electronics; Manufacturer Part Number: 5002; Plating: Silver; Material - Insulation: Nylon 46, UL 94V-0; Material - Body: Phosphor Bronze; Supplier 1: Digi-Key; RoHS: RoHS Compliant; Category: Test and Measurement; Stock 1: 329102; Pricing 1: 1=0.37, 10=0.316, 50=0.2298, 100=0.2209, 250=0.19832, 1000=0.1616, 2500=0.14424, 5000=0.13523 (USD); Packaging: Bulk; Part Status: Active; Type: PC Test Point, Miniature; Mounting Type: 0.040" (1.02mm) Hole Diameter; Color: White; Size / Dimension: 0.100" Dia x 0.180" L (2.54mm x 4.57mm); Height: -; ComponentLink1URL: http://www.keyelco.com/product-pdf.cfm?p=1311; ComponentLink1Description: http://www.keyelco.com/product-pdf.cfm?p=1311; Supplier Part Number 1: 36-5002-ND
C17 C22 = CAP CER 10UF 16V 20% X5R 0603: as C5 on sheet lps_display_rev_10_p1; Supplier 1: Digi-Key; RoHS: RoHS Compliant; Category: Capacitors; Stock 1: 99081; Pricing 1: 1=0.18, 10=0.167, 25=0.1428, 50=0.1214, 100=0.1167, 250=0.1048, 500=0.10002, 1000=0.08335 (USD); Packaging: Cut Tape (CT); Mounting Type: Surface Mount, MLCC; Operating Temperature: -55°C ~ 85°C; Applications: General Purpose; Ratings: -; Size / Dimension: 0.063" L x 0.031" W (1.60mm x 0.80mm); Height - Seated (Max): -; Thickness (Max): 0.031" (0.80mm); Lead Spacing: -; Features: -; Lead Style: -; ComponentLink1URL: http://www.murata.com/~/media/webrenewal/support/library/catalog/products/capacitor/mlcc/c02e.ashx; ComponentLink1Description: http://www.murata.com/~/media/webrenewal/support/library/catalog/products/capacitor/mlcc/c02e.ashx; Supplier Part Number 1: 490-7201-1-ND
C18 C19 C21 C23-C26 C33 C43 = CAP CER 0.1UF 50V 10% X7R 0603: as C8 on sheet lps_display_rev_10_p1; ClassName: *; Supplier 1: Digi-Key; RoHS: RoHS Compliant; Category: Capacitors; Stock 1: 2192156; Pricing 1: 1=0.1, 10=0.019, 100=0.0087, 500=0.0062, 1000=0.00487 (USD); Packaging: Cut Tape (CT); Part Status: Active; Operating Temperature: -30°C ~ 85°C; Features: -; Ratings: -; Applications: General Purpose; Failure Rate: -; Mounting Type: Surface Mount, MLCC; Size / Dimension: 0.063" L x 0.031" W (1.60mm x 0.80mm); Height - Seated (Max): -; Thickness (Max): 0.035" (0.90mm); Lead Spacing: -; Lead Style: -; ComponentLink1URL: http://www.yageo.com/documents/recent/UPY-GPHC_Y5V_6.3V-to-50V_8.pdf; ComponentLink1Description: http://www.yageo.com/documents/recent/UPY-GPHC_Y5V_6.3V-to-50V_8.pdf; Supplier Part Number 1: 311-1343-1-ND
C28 = CAP CER 1UF 10V 10% X5R 0603: 1uF 0603 10V; Manufacturer: Kemet; Manufacturer Part Number: C0603C105K8PACTU; Tolerance: ±10%; Temperature Coefficient: X5R; Supplier 1: Digi-Key; RoHS: RoHS Compliant; Category: Capacitors; Stock 1: 1121198; Pricing 1: 1=0.1, 10=0.043, 25=0.0304, 50=0.0232, 100=0.0196, 250=0.01608, 1000=0.0105 (USD); Packaging: Cut Tape (CT); Mounting Type: Surface Mount, MLCC; Operating Temperature: -55°C ~ 85°C; Applications: General Purpose; Ratings: -; Size / Dimension: 0.063" L x 0.031" W (1.60mm x 0.80mm); Height - Seated (Max): -; Thickness (Max): 0.035" (0.90mm); Lead Spacing: -; Features: -; Lead Style: -; ComponentLink1URL: http://www.kemet.com/datasheets&C0603C105K8PACTU; ComponentLink1Description: http://www.kemet.com/datasheets&C0603C105K8PACTU; Supplier Part Number 1: 399-3118-1-ND
C29 C30 = CMP-007-0143-08: CAP CER 33PF 50V 5% NP0 0603; Dielectric Material: Ceramic; Package (Metric): 1608; Temperature Coefficient: C0G, NP0; Tolerance: 5%; Mounting Type: SMD; Capacitance: 33pF
CN5 = CMP-001-0449-01: Mini-USB RA Type B 2A; Manufacturer Part Number: 54-00019; Manufacturer: Tensility International Corp; Mating Cycles: 5000; Gender: Receptacle; Number of Contacts: 5; Number of Ports: 1; Voltage - Rated: 30VDC; Connector Type: USB - mini B; Shielding: Unshielded; Features: Board Guide; ComponentLink1Description: http://www.tensility.com/pdffiles/54-00019.pdf; Component Name: Mini-USB RA Type B 2A 54-00019; RoHS: RoHS Compliant; Designator: Mini-USB RA Type B 2A 54-00019; Mounting Type: Through Hole, Right Angle; Operating Temperature: -10°C ~ 60°C; Pin Count: 6; Mounting Feature: Horizontal; Supplier Link 2: https://www.arrow.com/en/products/54-00019/tensility-international; Ingress Protection: -; Contact Finish: Gold; Insulation Color: Black; Current Rating: 2A; Pricing 1: 50=0.6202 (USD); Stock 1: 0; Specifications: -; Termination: Solder; Packaging: Tube; Material Flammability Rating: -; Part Status: Active; Shell/Shielding Material: Phosphor Bronze; ComponentLink1URL: http://www.tensility.com/pdffiles/54-00019.pdf
FB2 = FERRITE BEAD 120 OHM 0603 1LN: FERRITE 120 OHM 0603 500mA; Manufacturer: TDK Corporation; Manufacturer Part Number: MMZ1608R121ATA00; Filter Type: Signal Line; Number of Lines: 1; Impedance @ Frequency: 120 Ohm @ 100MHz; DC Resistance (DCR) (Max): 180 mOhm; ClassName: *; Creator: *; Supplier 1: Digi-Key; RoHS: RoHS Compliant; Category: Filters; Stock 1: 21122; Pricing 1: 1=0.1, 10=0.073, 100=0.0436, 250=0.03168, 500=0.02904, 1000=0.02508 (USD); Packaging: Cut Tape (CT); Part Status: Active; Current Rating (Max): 500mA; Ratings: -; Operating Temperature: -55°C ~ 125°C; Package / Case: 0603 (1608 Metric); Mounting Type: Surface Mount; Height (Max): 0.037" (0.95mm); Size / Dimension: 0.063" L x 0.031" W (1.60mm x 0.80mm); ComponentLink1URL: https://product.tdk.com/info/en/catalog/datasheets/beads_commercial_signal_mmz1608_en.pdf; ComponentLink1Description: https://product.tdk.com/info/en/catalog/datasheets/beads_commercial_signal_mmz1608_en.pdf; Supplier Part Number 1: 445-2170-1-ND
LED2-LED6 = 0603 LED: as LED1 on sheet lps_display_rev_10_p1
R3 R4 R13 R26 R32 = RES 1K OHM 1% 1/10W 0603: as R23 on sheet lps_display_rev_10_p1; Supplier 1: Digi-Key; RoHS: RoHS Compliant; Category: Resistors; Stock 1: 411308; Pricing 1: 1=0.1, 10=0.02, 100=0.0081, 1000=0.00364, 2500=0.00316 (USD); Packaging: Cut Tape (CT); Part Status: Active; Composition: Thick Film; Features: Automotive AEC-Q200; Operating Temperature: -55°C ~ 155°C; Size / Dimension: 0.061" L x 0.031" W (1.55mm x 0.80mm); Height - Seated (Max): 0.022" (0.55mm); Failure Rate: -; ComponentLink1URL: https://www.seielect.com/Catalog/SEI-RMCF_RMCP.pdf; ComponentLink1Description: https://www.seielect.com/Catalog/SEI-RMCF_RMCP.pdf; Supplier Part Number 1: RMCF0603FT1K00CT-ND; Supplier Device Package: 0603
  R3 R4 R13: Resistance (Ohms): 1.0k
R25 R34 = RES 100K OHM 1% 1/10W 0603: as R18 on sheet lps_display_rev_10_p1; Supplier 1: Digi-Key; RoHS: RoHS Compliant; Category: Resistors; Stock 1: 13526613; Pricing 1: 1=0.1, 10=0.015, 100=0.006, 1000=0.00268, 2500=0.00233 (USD); Packaging: Cut Tape (CT); Part Status: Active; Composition: Thick Film; Features: Moisture Resistant; Operating Temperature: -55°C ~ 155°C; Package / Case: 0603 (1608 Metric); Size / Dimension: 0.063" L x 0.032" W (1.60mm x 0.80mm); Height - Seated (Max): 0.022" (0.55mm); Failure Rate: -; ComponentLink1URL: http://www.yageo.com/documents/recent/PYu-RC_Group_51_RoHS_L_8.pdf; ComponentLink1Description: http://www.yageo.com/documents/recent/PYu-RC_Group_51_RoHS_L_8.pdf; Supplier Part Number 1: 311-100KHRCT-ND
R29 R30 = RES 100 OHM 1% 1/10W 0603 2017: 100 0603; Manufacturer: Vishay Dale; Manufacturer Part Number: CRCW0603100RFKEC; Tolerance: ±1%; Power (Watts): 0.1W, 1/10W; Temperature Coefficient: ±100ppm/°C; Supplier 1: Digi-Key; RoHS: RoHS Compliant; Category: Resistors; Stock 1: 25979; Pricing 1: 1=0.1, 10=0.033, 100=0.0136, 1000=0.00609, 2500=0.00529, 5000=0.00437 (USD); Packaging: Cut Tape (CT); Part Status: Active; Resistance (Ohms): 100; Composition: Thick Film; Features: Automotive AEC-Q200; Operating Temperature: -55°C ~ 155°C; Supplier Device Package: 0603; Size / Dimension: 0.063" L x 0.033" W (1.60mm x 0.85mm); Height - Seated (Max): 0.020" (0.50mm); Failure Rate: -; ComponentLink1URL: http://www.vishay.com/docs/20035/dcrcwe3.pdf; ComponentLink1Description: http://www.vishay.com/docs/20035/dcrcwe3.pdf; Supplier Part Number 1: 541-2975-1-ND
R31 = RES 10K OHM 1/10W 1% 0603 SMD: 10K 0603; Manufacturer: Panasonic Electronic Components; Manufacturer Part Number: ERJ-3EKF1002V; Power (Watts): 0.1W, 1/10W; Temperature Coefficient: ±100ppm/°C; Category: Resistors; Supplier 1: Digi-Key; RoHS: RoHS Compliant; Stock 1: 5046430; Pricing 1: 1=0.1, 50=0.015, 100=0.0114, 250=0.00844, 500=0.00624, 1000=0.00416, 2500=0.00351 (USD); Packaging: Cut Tape (CT); Tolerance: ±1%; Composition: Thick Film; Features: -; Supplier Device Package: 0603; Size / Dimension: 0.063" L x 0.031" W (1.60mm x 0.80mm); Height: 0.022" (0.55mm); Number of Terminations: 2; ComponentLink1URL: http://industrial.panasonic.com/www-cgi/jvcr13pz.cgi?E+PZ+3+AOA0002+ERJ3EKF1002V+7+WW; ComponentLink1Description: http://industrial.panasonic.com/www-cgi/jvcr13pz.cgi?E+PZ+3+AOA0002+ERJ3EKF1002V+7+WW; Supplier Part Number 1: P10.0KHCT-ND
R35 R36 = CMP-001-0711-04: Res Thick Film 0603 22 Ohm 5% 1/10W ±100ppm/C Molded SMD Paper T/R; Max Power Dissipation: 100mW; Package (Metric): 1608; Temperature Coefficient: 100ppm/°C; Power Rating: 100mW; Mount: Surface Mount; Termination: SMD/SMT; Power: 100mW; Height: 550µm; Length: 1.55mm; Min Operating Temperature: -55°C; Width: 800µm; Tolerance: 5%; Max Operating Temperature: 155°C
R38 = RES 4.7K OHM 1/10W 5% 0603 SMD: as R1 on sheet lps_display_rev_10_p1; Supplier 1: Digi-Key; RoHS: RoHS Compliant; Category: Resistors; Stock 1: 1261582; Pricing 1: 1=0.1, 50=0.0126, 100=0.0096, 250=0.00716, 500=0.00528, 1000=0.00352, 2500=0.00297 (USD); Packaging: Cut Tape (CT); Composition: Thick Film; Features: Automotive AEC-Q200 Qualified; Supplier Device Package: 0603; Size / Dimension: 0.063" L x 0.031" W (1.60mm x 0.80mm); Height: 0.022" (0.55mm); Number of Terminations: 2; ComponentLink1URL: http://industrial.panasonic.com/www-cgi/jvcr13pz.cgi?E+PZ+3+AOA0001+ERJ3GEYJ472V+7+WW; ComponentLink1Description: http://industrial.panasonic.com/www-cgi/jvcr13pz.cgi?E+PZ+3+AOA0001+ERJ3GEYJ472V+7+WW; Supplier Part Number 1: P4.7KGCT-ND
R47 = CMP-007-0337-12: RES 1.54K OHM 1/10W 1% 0603 SMD; Package (Metric): 1608; Temperature Coefficient: ±100ppm/°C; Power: 100mW; Termination: SMD/SMT; Tolerance: 1%; Height: 550µm
R51-R54 = CMP-001-0749-04: ERJ3EKF5101V             SMD Chip Resistor, Thick Film, 5.1 kohm, 75 V, 0603, 100 mW,  1%, ERJ3E Series; Power: 100mW; Package (Metric): 1608; Temperature Coefficient: 100ppm/°C; Termination: SMD/SMT; Mount: Surface Mount; Height: 800µm; Tolerance: 1%; Max Operating Temperature: 155°C; Depth: 0.8mm; Max Power Dissipation: 100mW; Resistance: 5.1k; Length: 1.6mm; Power Rating: 100mW; Width: 800µm; Min Operating Temperature: -55°C
U5 = stm32f103rbt6
U8 = AT42QT1070: QTouch IC
X1 = CMP-001-1264-01: XTAL OSC TCXO 12.0000MHZ HCMOS; Frequency Stability: 2.5ppm; Frequency: 12MHz; Max Supply Current: 4.8mA; Case/Package: SMD/SMT; Packaging: Tape and Reel; Mount: Surface Mount; Max Operating Temperature: 85°C; Min Operating Temperature: -40°C

## Nets that join several sheets
3V3: lps_display_rev_10_p1 (23 pins), lps_display_rev_10_p2 (28 pins)
GND: lps_display_rev_10_p1 (72 pins), lps_display_rev_10_p2 (35 pins)
/CAP_T_INT: lps_display_rev_10_p1 (U1.27), lps_display_rev_10_p2 (R54.1 U5.61 U8.5)
/INT: lps_display_rev_10_p1 (R8.1 U1.19 U1.20), lps_display_rev_10_p2 (U5.26)
/RST_MCP23017: lps_display_rev_10_p1 (R11.1 U1.18), lps_display_rev_10_p2 (U5.62)
/RST_OLED: lps_display_rev_10_p1 (R48.1 U2.16), lps_display_rev_10_p2 (U5.30)
Current_Limit: lps_display_rev_10_p1 (CN1.11), lps_display_rev_10_p2 (U5.34)
D/C_OLED: lps_display_rev_10_p1 (U2.4), lps_display_rev_10_p2 (U5.29)
I2C_SCL: lps_display_rev_10_p1 (CN1.9 R10.1 U1.12), lps_display_rev_10_p2 (U5.58 U8.6)
I2C_SDA: lps_display_rev_10_p1 (CN1.10 R9.1 U1.13), lps_display_rev_10_p2 (U5.59 U8.3)
I_Sample: lps_display_rev_10_p1 (CN1.3), lps_display_rev_10_p2 (U5.15)
OUTPUT_ENB: lps_display_rev_10_p1 (CN1.12), lps_display_rev_10_p2 (U5.33)
Spare1: lps_display_rev_10_p1 (CN1.2), lps_display_rev_10_p2 (U5.55)
Spare2: lps_display_rev_10_p1 (CN1.1), lps_display_rev_10_p2 (U5.56)
SPI_MOSI_1: lps_display_rev_10_p1 (U2.8), lps_display_rev_10_p2 (U5.23)
SPI_NSS_1: lps_display_rev_10_p1 (U2.17), lps_display_rev_10_p2 (U5.20)
SPI_SCK_1: lps_display_rev_10_p1 (U2.7), lps_display_rev_10_p2 (U5.21)
VIN_CHK: lps_display_rev_10_p1 (C32.1 R23.1 R37.2), lps_display_rev_10_p2 (U5.14)